# Altium project 16Ch_Multi_INA219.PrjPcb
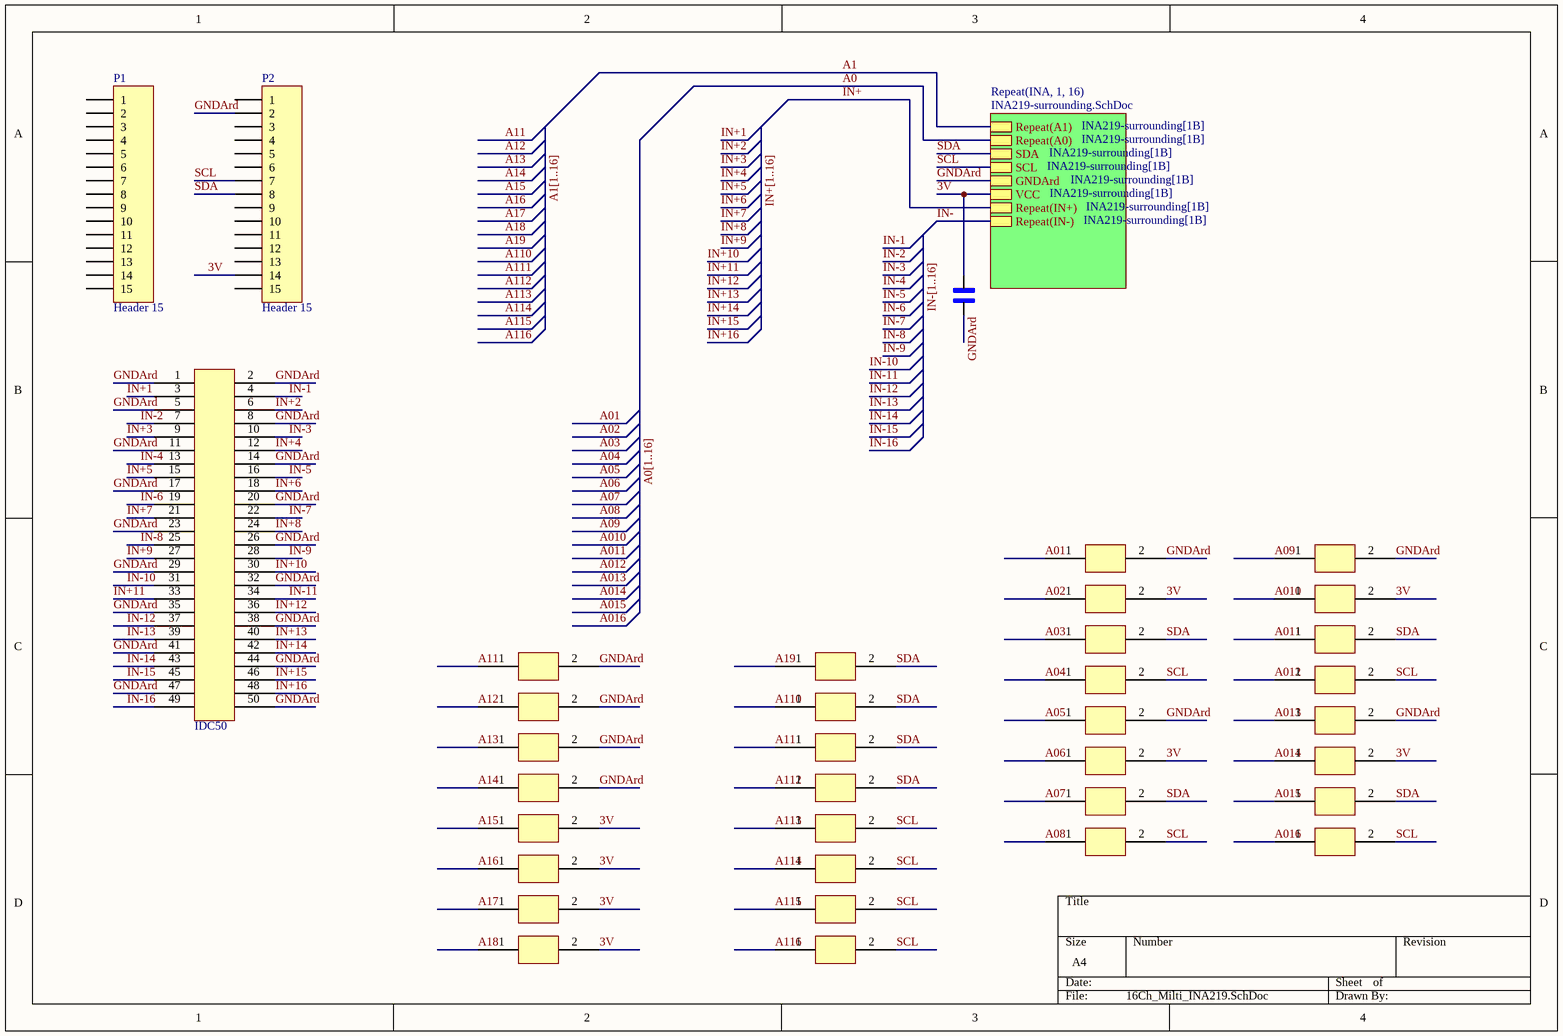
[diagram p0: 16Ch_Milti_INA219.SchDoc]
2 sheets, 84 parts. Net scope: strictly hierarchical (ports join the sheet entries above them; power ports are local).
Board file: 16Ch_Milti_INA219.PcbDoc
Sheets:
  16Ch_Milti_INA219.SchDoc
    INA1 = INA219-surrounding.SchDoc
    INA2 = INA219-surrounding.SchDoc
    INA3 = INA219-surrounding.SchDoc
    INA4 = INA219-surrounding.SchDoc
    INA5 = INA219-surrounding.SchDoc
    INA6 = INA219-surrounding.SchDoc
    INA7 = INA219-surrounding.SchDoc
    INA8 = INA219-surrounding.SchDoc
    INA9 = INA219-surrounding.SchDoc
    INA10 = INA219-surrounding.SchDoc
    INA11 = INA219-surrounding.SchDoc
    INA12 = INA219-surrounding.SchDoc
    INA13 = INA219-surrounding.SchDoc
    INA14 = INA219-surrounding.SchDoc
    INA15 = INA219-surrounding.SchDoc
    INA16 = INA219-surrounding.SchDoc

## Sheet 16Ch_Milti_INA219.SchDoc
size A4; SheetNumber: 1; SheetTotal: 2

### Parts
*1  IDC50  [IDC50]
P1  Header 15  [HDR1X15]
P2  Header 15  [HDR1X15]
R1  RES0603  [RES0603]  (value not drawn)
R2  RES0603  [RES0603]  (value not drawn)
R3  RES0603  [RES0603]  (value not drawn)
R4  RES0603  [RES0603]  (value not drawn)
R5  RES0603  [RES0603]  (value not drawn)
R6  RES0603  [RES0603]  (value not drawn)
R7  RES0603  [RES0603]  (value not drawn)
R8  RES0603  [RES0603]  (value not drawn)
R9  RES0603  [RES0603]  (value not drawn)
R10  RES0603  [RES0603]  (value not drawn)
R11  RES0603  [RES0603]  (value not drawn)
R12  RES0603  [RES0603]  (value not drawn)
R13  RES0603  [RES0603]  (value not drawn)
R14  RES0603  [RES0603]  (value not drawn)
R15  RES0603  [RES0603]  (value not drawn)
R16  RES0603  [RES0603]  (value not drawn)
R17  RES0603  [RES0603]  (value not drawn)
R18  RES0603  [RES0603]  (value not drawn)
R19  RES0603  [RES0603]  (value not drawn)
R20  RES0603  [RES0603]  (value not drawn)
R21  RES0603  [RES0603]  (value not drawn)
R22  RES0603  [RES0603]  (value not drawn)
R23  RES0603  [RES0603]  (value not drawn)
R24  RES0603  [RES0603]  (value not drawn)
R25  RES0603  [RES0603]  (value not drawn)
R26  RES0603  [RES0603]  (value not drawn)
R27  RES0603  [RES0603]  (value not drawn)
R28  RES0603  [RES0603]  (value not drawn)
R29  RES0603  [RES0603]  (value not drawn)
R30  RES0603  [RES0603]  (value not drawn)
R31  RES0603  [RES0603]  (value not drawn)
R32  RES0603  [RES0603]  (value not drawn)
С1  CAP0805  [CAP0805]  (value not drawn)

### Sub-sheets
Repeat(INA, 1, 16) = INA219-surrounding.SchDoc: Repeat(A1), Repeat(A0), SDA, SCL, GNDArd, VCC, Repeat(IN+), Repeat(IN-)

### Nets
3V: P2.14 R5.2 R6.2 R7.2 R8.2 R18.2 R22.2 R26.2 R30.2 С1.2 ; sheet Repeat(INA, 1, 16)/VCC
A0: sheet Repeat(INA, 1, 16)/Repeat(A0)
A01: R17.1  [project net A0]
A1: sheet Repeat(INA, 1, 16)/Repeat(A1)
A02: R18.1  [project net A0]
A03: R19.1  [project net A0]
A04: R20.1  [project net A0]
A05: R21.1  [project net A0]
A06: R22.1  [project net A0]
A07: R23.1  [project net A0]
A08: R24.1  [project net A0]
A09: R25.1  [project net A0]
A010: R26.1  [project net A0]
A11: R1.1  [project net A1]
A011: R27.1  [project net A0]
A12: R2.1  [project net A1]
A012: R28.1  [project net A0]
A13: R3.1  [project net A1]
A013: R29.1  [project net A0]
A14: R4.1  [project net A1]
A014: R30.1  [project net A0]
A15: R5.1  [project net A1]
A015: R31.1  [project net A0]
A16: R6.1  [project net A1]
A016: R32.1  [project net A0]
A17: R7.1  [project net A1]
A18: R8.1  [project net A1]
A19: R9.1  [project net A1]
A110: R10.1  [project net A1]
A111: R11.1  [project net A1]
A112: R12.1  [project net A1]
A113: R13.1  [project net A1]
A114: R14.1  [project net A1]
A115: R15.1  [project net A1]
A116: R16.1  [project net A1]
GNDArd: *1.1 *1.2 *1.5 *1.8 *1.11 *1.14 *1.17 *1.20 *1.23 *1.26 *1.29 *1.32 *1.35 *1.38 *1.41 *1.44 *1.47 *1.50 P2.2 R1.2 R2.2 R3.2 R4.2 R17.2 R21.2 R25.2 R29.2 С1.1 ; sheet Repeat(INA, 1, 16)/GNDArd
IN+: sheet Repeat(INA, 1, 16)/Repeat(IN+)
IN+1: *1.3  [project net IN+]
IN+2: *1.6  [project net IN+]
IN+3: *1.9  [project net IN+]
IN+4: *1.12  [project net IN+]
IN+5: *1.15  [project net IN+]
IN+6: *1.18  [project net IN+]
IN+7: *1.21  [project net IN+]
IN+8: *1.24  [project net IN+]
IN+9: *1.27  [project net IN+]
IN+10: *1.30  [project net IN+]
IN+11: *1.33  [project net IN+]
IN+12: *1.36  [project net IN+]
IN+13: *1.40  [project net IN+]
IN+14: *1.42  [project net IN+]
IN+15: *1.46  [project net IN+]
IN+16: *1.48  [project net IN+]
IN-: sheet Repeat(INA, 1, 16)/Repeat(IN-)
IN-1: *1.4  [project net IN-]
IN-2: *1.7  [project net IN-]
IN-3: *1.10  [project net IN-]
IN-4: *1.13  [project net IN-]
IN-5: *1.16  [project net IN-]
IN-6: *1.19  [project net IN-]
IN-7: *1.22  [project net IN-]
IN-8: *1.25  [project net IN-]
IN-9: *1.28  [project net IN-]
IN-10: *1.31  [project net IN-]
IN-11: *1.34  [project net IN-]
IN-12: *1.37  [project net IN-]
IN-13: *1.39  [project net IN-]
IN-14: *1.43  [project net IN-]
IN-15: *1.45  [project net IN-]
IN-16: *1.49  [project net IN-]
SCL: P2.7 R13.2 R14.2 R15.2 R16.2 R20.2 R24.2 R28.2 R32.2 ; sheet Repeat(INA, 1, 16)/SCL
SDA: P2.8 R9.2 R10.2 R11.2 R12.2 R19.2 R23.2 R27.2 R31.2 ; sheet Repeat(INA, 1, 16)/SDA

Not connected (* = marked no-connect by the designer): P1 1 2 3 4 5 6 7 8 9 10 11 12 13 14 15; P2 1 3 4 5 6 9 10 11 12 13 15

### Buses and harness runs
bus A0[1..16]
bus A1[1..16]
bus IN+[1..16]
bus IN-[1..16]

### Library data of the parts
P1 P2 = Header 15: Header, 15-Pin; LatestRevisionDate: 17-Jul-2002; LatestRevisionNote: Re-released for DXP Platform.; Publisher: Altium Limited

## Sheet INA219-surrounding.SchDoc
size A4; SheetNumber: 2; SheetTotal: 2
Used 16 times, as channels INA1, INA2, INA3, INA4, INA5, INA6, INA7, INA8, INA9, INA10, INA11, INA12, INA13, INA14, INA15, INA16. Parts and nets are listed once, with the designators drawn on the sheet.
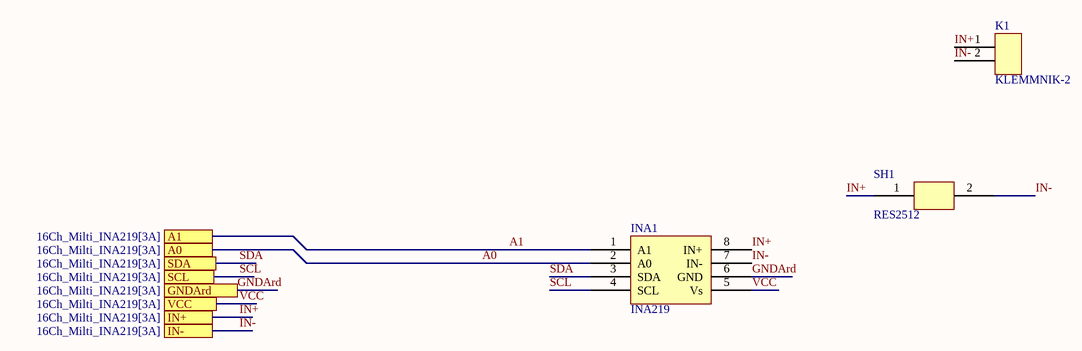
[diagram p1: INA219-surrounding.SchDoc]

### Parts
INA1  INA219  [INA219]
K1  KLEMMNIK-2  [KLEMMNIK-2]
SH1  RES2512  [RES2512]

### Ports
A0 (see 16Ch_Milti_INA219[3A]), A1 (see 16Ch_Milti_INA219[3A]), GNDArd (see 16Ch_Milti_INA219[3A]), IN+ (see 16Ch_Milti_INA219[3A]), IN- (see 16Ch_Milti_INA219[3A]), SCL (see 16Ch_Milti_INA219[3A]), SDA (see 16Ch_Milti_INA219[3A]), VCC (see 16Ch_Milti_INA219[3A])

### Nets
A0: INA1.2(A0) ; port A0
A1: INA1.1(A1) ; port A1
GNDArd: INA1.6(GND) ; port GNDArd
IN+: INA1.8(IN+) K1.1 SH1.1 ; port IN+
IN-: INA1.7(IN-) K1.2 SH1.2 ; port IN-
SCL: INA1.4(SCL) ; port SCL
SDA: INA1.3(SDA) ; port SDA
VCC: INA1.5(Vs) ; port VCC

### Channels
INA1: designators end in _INA1; ports A0=A0 A1=A1 GNDArd=GNDArd IN+=IN+ IN-=IN- SCL=SCL SDA=SDA VCC=3V
INA2: designators end in _INA2; ports A0=A0 A1=A1 GNDArd=GNDArd IN+=IN+ IN-=IN- SCL=SCL SDA=SDA VCC=3V
INA3: designators end in _INA3; ports A0=A0 A1=A1 GNDArd=GNDArd IN+=IN+ IN-=IN- SCL=SCL SDA=SDA VCC=3V
INA4: designators end in _INA4; ports A0=A0 A1=A1 GNDArd=GNDArd IN+=IN+ IN-=IN- SCL=SCL SDA=SDA VCC=3V
INA5: designators end in _INA5; ports A0=A0 A1=A1 GNDArd=GNDArd IN+=IN+ IN-=IN- SCL=SCL SDA=SDA VCC=3V
INA6: designators end in _INA6; ports A0=A0 A1=A1 GNDArd=GNDArd IN+=IN+ IN-=IN- SCL=SCL SDA=SDA VCC=3V
INA7: designators end in _INA7; ports A0=A0 A1=A1 GNDArd=GNDArd IN+=IN+ IN-=IN- SCL=SCL SDA=SDA VCC=3V
INA8: designators end in _INA8; ports A0=A0 A1=A1 GNDArd=GNDArd IN+=IN+ IN-=IN- SCL=SCL SDA=SDA VCC=3V
INA9: designators end in _INA9; ports A0=A0 A1=A1 GNDArd=GNDArd IN+=IN+ IN-=IN- SCL=SCL SDA=SDA VCC=3V
INA10: designators end in _INA10; ports A0=A0 A1=A1 GNDArd=GNDArd IN+=IN+ IN-=IN- SCL=SCL SDA=SDA VCC=3V
INA11: designators end in _INA11; ports A0=A0 A1=A1 GNDArd=GNDArd IN+=IN+ IN-=IN- SCL=SCL SDA=SDA VCC=3V
INA12: designators end in _INA12; ports A0=A0 A1=A1 GNDArd=GNDArd IN+=IN+ IN-=IN- SCL=SCL SDA=SDA VCC=3V
INA13: designators end in _INA13; ports A0=A0 A1=A1 GNDArd=GNDArd IN+=IN+ IN-=IN- SCL=SCL SDA=SDA VCC=3V
INA14: designators end in _INA14; ports A0=A0 A1=A1 GNDArd=GNDArd IN+=IN+ IN-=IN- SCL=SCL SDA=SDA VCC=3V
INA15: designators end in _INA15; ports A0=A0 A1=A1 GNDArd=GNDArd IN+=IN+ IN-=IN- SCL=SCL SDA=SDA VCC=3V
INA16: designators end in _INA16; ports A0=A0 A1=A1 GNDArd=GNDArd IN+=IN+ IN-=IN- SCL=SCL SDA=SDA VCC=3V

## Nets that join several sheets
3V: 16Ch_Milti_INA219 (10 pins), INA1 (INA1_INA1.5), INA2 (INA1_INA2.5), INA3 (INA1_INA3.5), INA4 (INA1_INA4.5), INA5 (INA1_INA5.5), INA6 (INA1_INA6.5), INA7 (INA1_INA7.5), INA8 (INA1_INA8.5), INA9 (INA1_INA9.5), INA10 (INA1_INA10.5), INA11 (INA1_INA11.5), INA12 (INA1_INA12.5), INA13 (INA1_INA13.5), INA14 (INA1_INA14.5), INA15 (INA1_INA15.5), INA16 (INA1_INA16.5)
A0: 16Ch_Milti_INA219 (R17.1), INA1 (INA1_INA1.2)
A0: 16Ch_Milti_INA219 (R18.1), INA2 (INA1_INA2.2)
A0: 16Ch_Milti_INA219 (R19.1), INA3 (INA1_INA3.2)
A0: 16Ch_Milti_INA219 (R20.1), INA4 (INA1_INA4.2)
A0: 16Ch_Milti_INA219 (R21.1), INA5 (INA1_INA5.2)
A0: 16Ch_Milti_INA219 (R22.1), INA6 (INA1_INA6.2)
A0: 16Ch_Milti_INA219 (R23.1), INA7 (INA1_INA7.2)
A0: 16Ch_Milti_INA219 (R24.1), INA8 (INA1_INA8.2)
A0: 16Ch_Milti_INA219 (R25.1), INA9 (INA1_INA9.2)
A0: 16Ch_Milti_INA219 (R26.1), INA10 (INA1_INA10.2)
A0: 16Ch_Milti_INA219 (R27.1), INA11 (INA1_INA11.2)
A0: 16Ch_Milti_INA219 (R28.1), INA12 (INA1_INA12.2)
A0: 16Ch_Milti_INA219 (R29.1), INA13 (INA1_INA13.2)
A0: 16Ch_Milti_INA219 (R30.1), INA14 (INA1_INA14.2)
A0: 16Ch_Milti_INA219 (R31.1), INA15 (INA1_INA15.2)
A0: 16Ch_Milti_INA219 (R32.1), INA16 (INA1_INA16.2)
A1: 16Ch_Milti_INA219 (R2.1), INA2 (INA1_INA2.1)
A1: 16Ch_Milti_INA219 (R3.1), INA3 (INA1_INA3.1)
A1: 16Ch_Milti_INA219 (R1.1), INA1 (INA1_INA1.1)
A1: 16Ch_Milti_INA219 (R4.1), INA4 (INA1_INA4.1)
A1: 16Ch_Milti_INA219 (R5.1), INA5 (INA1_INA5.1)
A1: 16Ch_Milti_INA219 (R6.1), INA6 (INA1_INA6.1)
A1: 16Ch_Milti_INA219 (R7.1), INA7 (INA1_INA7.1)
A1: 16Ch_Milti_INA219 (R8.1), INA8 (INA1_INA8.1)
A1: 16Ch_Milti_INA219 (R10.1), INA10 (INA1_INA10.1)
A1: 16Ch_Milti_INA219 (R11.1), INA11 (INA1_INA11.1)
A1: 16Ch_Milti_INA219 (R9.1), INA9 (INA1_INA9.1)
A1: 16Ch_Milti_INA219 (R12.1), INA12 (INA1_INA12.1)
A1: 16Ch_Milti_INA219 (R13.1), INA13 (INA1_INA13.1)
A1: 16Ch_Milti_INA219 (R14.1), INA14 (INA1_INA14.1)
A1: 16Ch_Milti_INA219 (R15.1), INA15 (INA1_INA15.1)
A1: 16Ch_Milti_INA219 (R16.1), INA16 (INA1_INA16.1)
GNDArd: 16Ch_Milti_INA219 (28 pins), INA1 (INA1_INA1.6), INA2 (INA1_INA2.6), INA3 (INA1_INA3.6), INA4 (INA1_INA4.6), INA5 (INA1_INA5.6), INA6 (INA1_INA6.6), INA7 (INA1_INA7.6), INA8 (INA1_INA8.6), INA9 (INA1_INA9.6), INA10 (INA1_INA10.6), INA11 (INA1_INA11.6), INA12 (INA1_INA12.6), INA13 (INA1_INA13.6), INA14 (INA1_INA14.6), INA15 (INA1_INA15.6), INA16 (INA1_INA16.6)
IN+: 16Ch_Milti_INA219 (*1.3), INA1 (INA1_INA1.8 K1_INA1.1 SH1_INA1.1)
IN+: 16Ch_Milti_INA219 (*1.9), INA3 (INA1_INA3.8 K1_INA3.1 SH1_INA3.1)
IN+: 16Ch_Milti_INA219 (*1.15), INA5 (INA1_INA5.8 K1_INA5.1 SH1_INA5.1)
IN+: 16Ch_Milti_INA219 (*1.21), INA7 (INA1_INA7.8 K1_INA7.1 SH1_INA7.1)
IN+: 16Ch_Milti_INA219 (*1.27), INA9 (INA1_INA9.8 K1_INA9.1 SH1_INA9.1)
IN+: 16Ch_Milti_INA219 (*1.33), INA11 (INA1_INA11.8 K1_INA11.1 SH1_INA11.1)
IN+: 16Ch_Milti_INA219 (*1.48), INA16 (INA1_INA16.8 K1_INA16.1 SH1_INA16.1)
IN+: 16Ch_Milti_INA219 (*1.46), INA15 (INA1_INA15.8 K1_INA15.1 SH1_INA15.1)
IN+: 16Ch_Milti_INA219 (*1.42), INA14 (INA1_INA14.8 K1_INA14.1 SH1_INA14.1)
IN+: 16Ch_Milti_INA219 (*1.40), INA13 (INA1_INA13.8 K1_INA13.1 SH1_INA13.1)
IN+: 16Ch_Milti_INA219 (*1.36), INA12 (INA1_INA12.8 K1_INA12.1 SH1_INA12.1)
IN+: 16Ch_Milti_INA219 (*1.30), INA10 (INA1_INA10.8 K1_INA10.1 SH1_INA10.1)
IN+: 16Ch_Milti_INA219 (*1.24), INA8 (INA1_INA8.8 K1_INA8.1 SH1_INA8.1)
IN+: 16Ch_Milti_INA219 (*1.18), INA6 (INA1_INA6.8 K1_INA6.1 SH1_INA6.1)
IN+: 16Ch_Milti_INA219 (*1.12), INA4 (INA1_INA4.8 K1_INA4.1 SH1_INA4.1)
IN+: 16Ch_Milti_INA219 (*1.6), INA2 (INA1_INA2.8 K1_INA2.1 SH1_INA2.1)
IN-: 16Ch_Milti_INA219 (*1.7), INA2 (INA1_INA2.7 K1_INA2.2 SH1_INA2.2)
IN-: 16Ch_Milti_INA219 (*1.13), INA4 (INA1_INA4.7 K1_INA4.2 SH1_INA4.2)
IN-: 16Ch_Milti_INA219 (*1.19), INA6 (INA1_INA6.7 K1_INA6.2 SH1_INA6.2)
IN-: 16Ch_Milti_INA219 (*1.25), INA8 (INA1_INA8.7 K1_INA8.2 SH1_INA8.2)
IN-: 16Ch_Milti_INA219 (*1.31), INA10 (INA1_INA10.7 K1_INA10.2 SH1_INA10.2)
IN-: 16Ch_Milti_INA219 (*1.37), INA12 (INA1_INA12.7 K1_INA12.2 SH1_INA12.2)
IN-: 16Ch_Milti_INA219 (*1.39), INA13 (INA1_INA13.7 K1_INA13.2 SH1_INA13.2)
IN-: 16Ch_Milti_INA219 (*1.43), INA14 (INA1_INA14.7 K1_INA14.2 SH1_INA14.2)
IN-: 16Ch_Milti_INA219 (*1.45), INA15 (INA1_INA15.7 K1_INA15.2 SH1_INA15.2)
IN-: 16Ch_Milti_INA219 (*1.49), INA16 (INA1_INA16.7 K1_INA16.2 SH1_INA16.2)
IN-: 16Ch_Milti_INA219 (*1.34), INA11 (INA1_INA11.7 K1_INA11.2 SH1_INA11.2)
IN-: 16Ch_Milti_INA219 (*1.28), INA9 (INA1_INA9.7 K1_INA9.2 SH1_INA9.2)
IN-: 16Ch_Milti_INA219 (*1.22), INA7 (INA1_INA7.7 K1_INA7.2 SH1_INA7.2)
IN-: 16Ch_Milti_INA219 (*1.16), INA5 (INA1_INA5.7 K1_INA5.2 SH1_INA5.2)
IN-: 16Ch_Milti_INA219 (*1.10), INA3 (INA1_INA3.7 K1_INA3.2 SH1_INA3.2)
IN-: 16Ch_Milti_INA219 (*1.4), INA1 (INA1_INA1.7 K1_INA1.2 SH1_INA1.2)
SCL: 16Ch_Milti_INA219 (9 pins), INA1 (INA1_INA1.4), INA2 (INA1_INA2.4), INA3 (INA1_INA3.4), INA4 (INA1_INA4.4), INA5 (INA1_INA5.4), INA6 (INA1_INA6.4), INA7 (INA1_INA7.4), INA8 (INA1_INA8.4), INA9 (INA1_INA9.4), INA10 (INA1_INA10.4), INA11 (INA1_INA11.4), INA12 (INA1_INA12.4), INA13 (INA1_INA13.4), INA14 (INA1_INA14.4), INA15 (INA1_INA15.4), INA16 (INA1_INA16.4)
SDA: 16Ch_Milti_INA219 (9 pins), INA1 (INA1_INA1.3), INA2 (INA1_INA2.3), INA3 (INA1_INA3.3), INA4 (INA1_INA4.3), INA5 (INA1_INA5.3), INA6 (INA1_INA6.3), INA7 (INA1_INA7.3), INA8 (INA1_INA8.3), INA9 (INA1_INA9.3), INA10 (INA1_INA10.3), INA11 (INA1_INA11.3), INA12 (INA1_INA12.3), INA13 (INA1_INA13.3), INA14 (INA1_INA14.3), INA15 (INA1_INA15.3), INA16 (INA1_INA16.3)